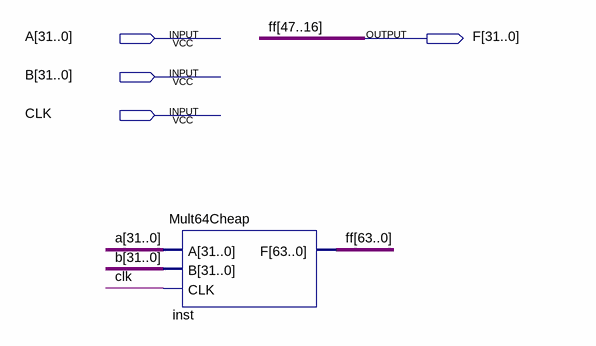
[diagram p0: schematic sheet]
// Quartus schematic real_mul_cheap.bdf as structural Verilog: 1 symbols, 4 pins
module real_mul_cheap (
  input  [31:0] A,
  input  [31:0] B,
  input  CLK,
  output [31:0] F
);

  wire [63:0] ff;

  Mult64Cheap inst (.A(A), .B(B), .CLK(CLK), .F({ff[63:48], F, ff[15:0]}));

  // Other names for the same wires on the sheet: ff[47:16] = F
endmodule
